# Altium project M_PCT_2.PrjPcb
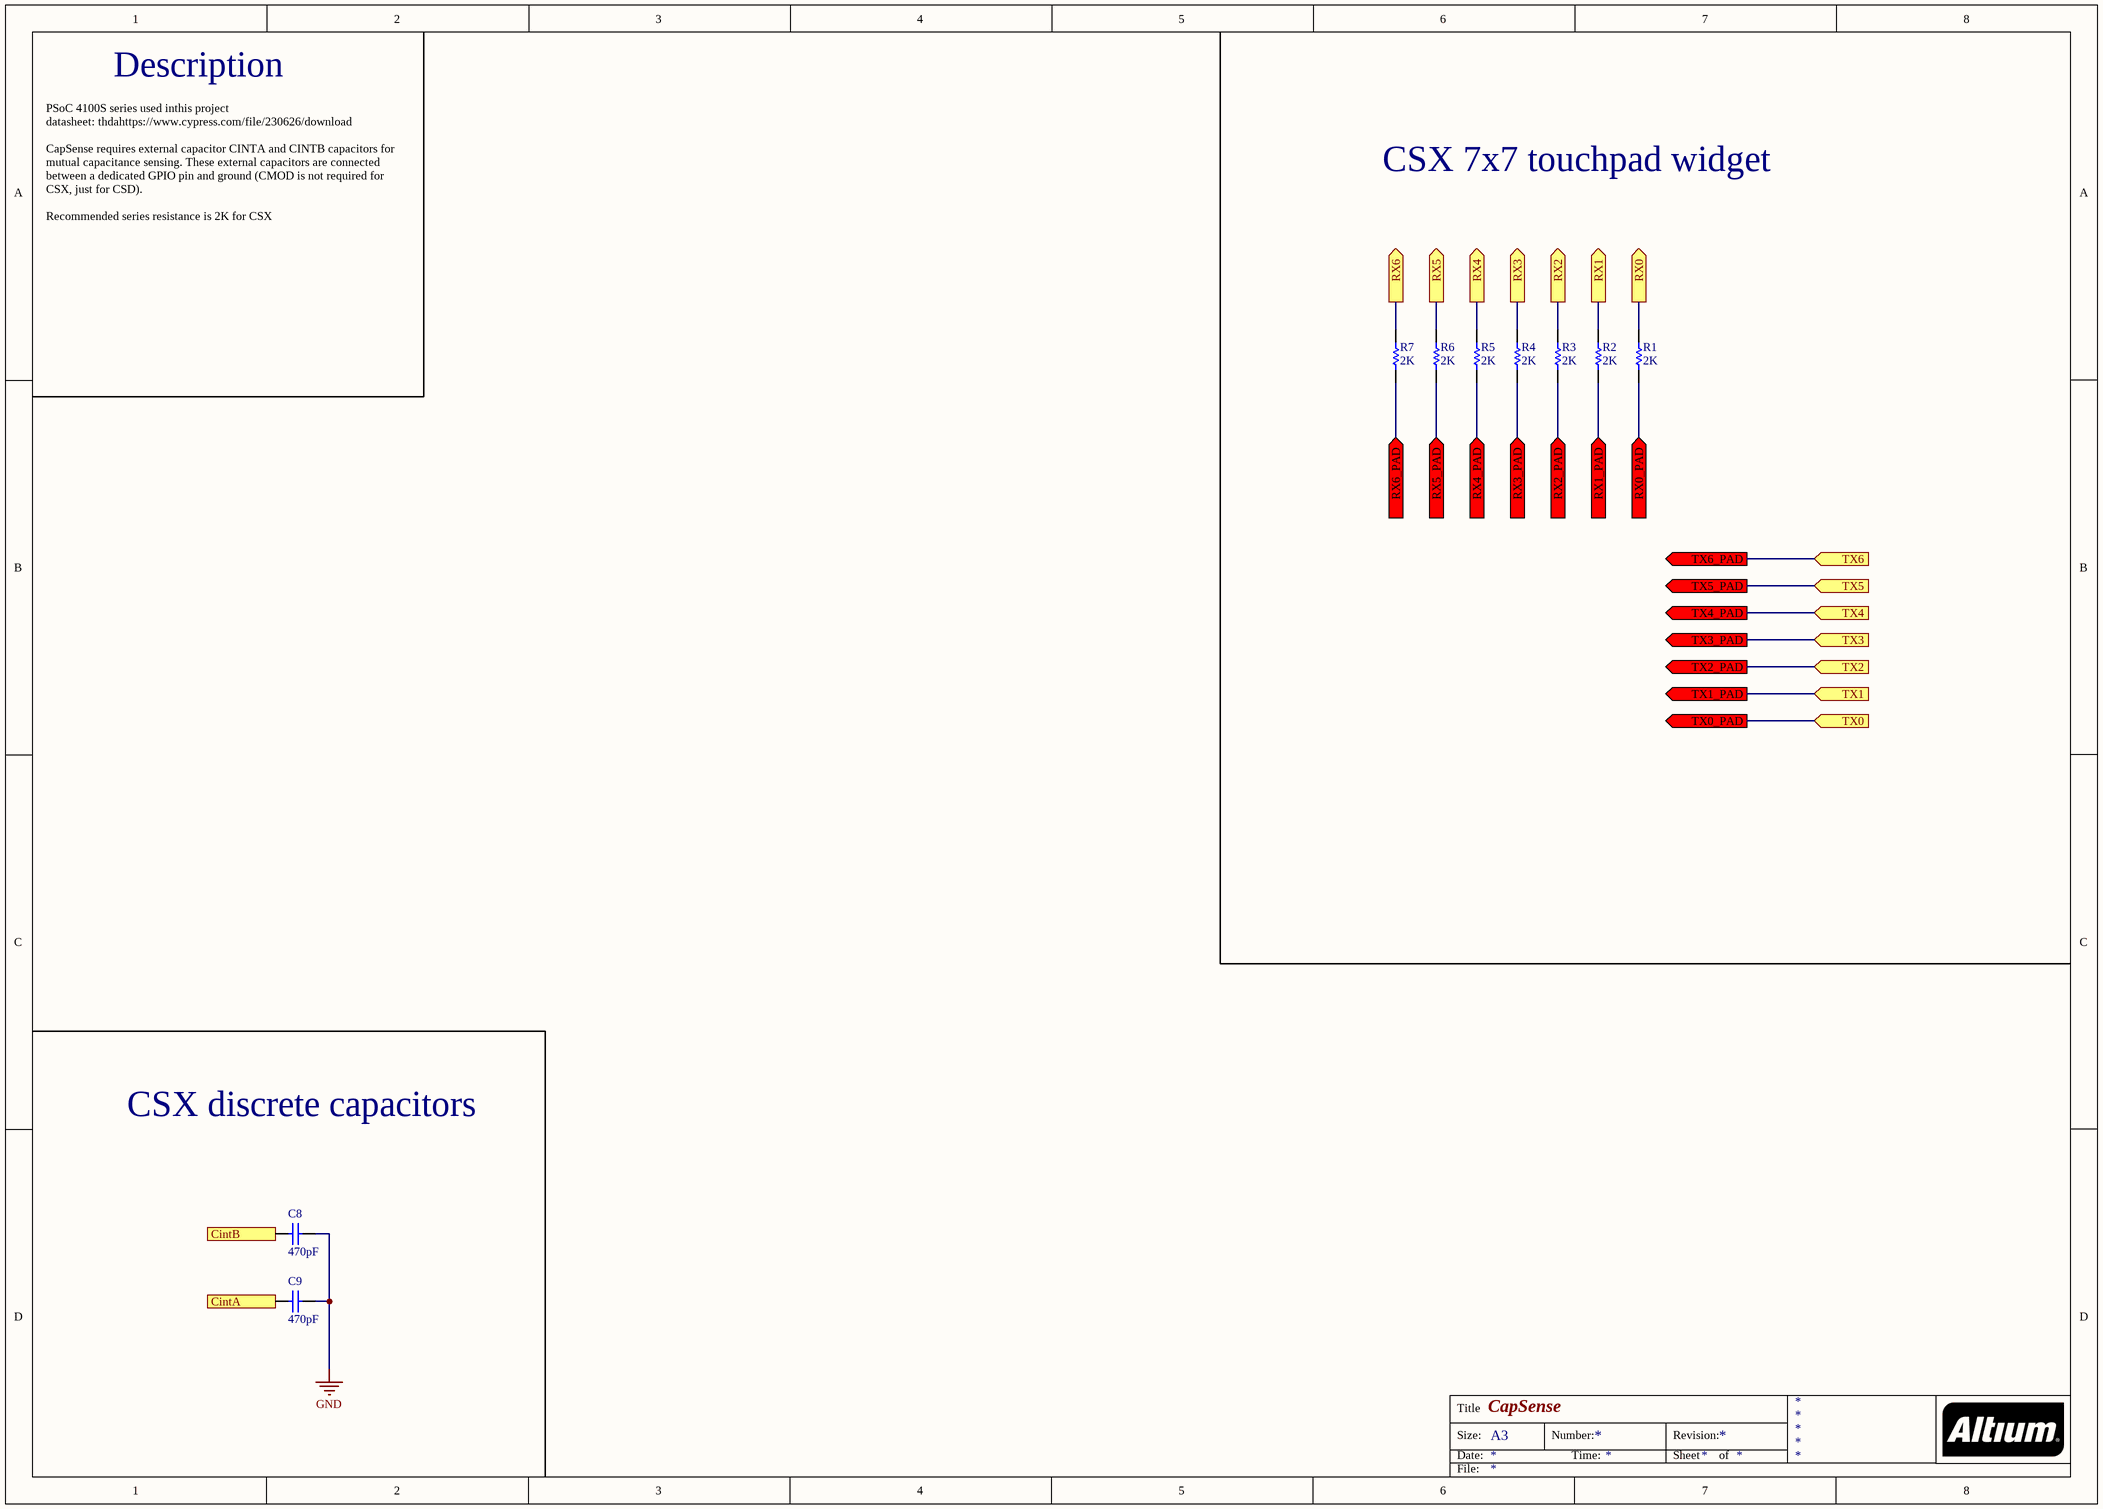
[diagram p0: CapSense.SchDoc]
3 sheets, 32 parts. Net scope: flat (ports and power ports of the same name join across sheets).
Board file: MPCT_v2_Manipora.PcbDoc
Sheets:
  CapSense.SchDoc
  CY8C4125AZI-S433.SchDoc
  Communication.SchDoc

## Sheet CapSense.SchDoc: CapSense
size A3

### Parts
C8  470pF  [CAPC0603(1608)100_N]
C9  470pF  [CAPC0603(1608)100_N]
R1  2K  [RESC0603(1608)_N]
R2  2K  [RESC0603(1608)_N]
R3  2K  [RESC0603(1608)_N]
R4  2K  [RESC0603(1608)_N]
R5  2K  [RESC0603(1608)_N]
R6  2K  [RESC0603(1608)_N]
R7  2K  [RESC0603(1608)_N]

### Ports
CintA, CintB, RX0 (out), RX0_PAD (in), RX1 (out), RX1_PAD (in), RX2 (out), RX2_PAD (in), RX3 (out), RX3_PAD (in), RX4 (out), RX4_PAD (in), RX5 (out), RX5_PAD (in), RX6 (out), RX6_PAD (in), TX0 (in), TX0_PAD (out), TX1 (in), TX1_PAD (out), TX2 (in), TX2_PAD (out), TX3 (in), TX3_PAD (out), TX4 (in), TX4_PAD (out), TX5 (in), TX5_PAD (out), TX6 (in), TX6_PAD (out)

### Nets
GND: C8.2 C9.2
CintA: C9.1 ; port CintA
CintB: C8.1 ; port CintB
RX0: R1.1 ; port RX0
RX0_PAD: R1.2 ; port RX0_PAD
RX1: R2.1 ; port RX1
RX1_PAD: R2.2 ; port RX1_PAD
RX2: R3.1 ; port RX2
RX2_PAD: R3.2 ; port RX2_PAD
RX3: R4.1 ; port RX3
RX3_PAD: R4.2 ; port RX3_PAD
RX4: R5.1 ; port RX4
RX4_PAD: R5.2 ; port RX4_PAD
RX5: R6.1 ; port RX5
RX5_PAD: R6.2 ; port RX5_PAD
RX6: R7.1 ; port RX6
RX6_PAD: R7.2 ; port RX6_PAD
TX0: port TX0, port TX0_PAD
TX1: port TX1, port TX1_PAD
TX2: port TX2, port TX2_PAD
TX3: port TX3, port TX3_PAD
TX4: port TX4, port TX4_PAD
TX5: port TX5, port TX5_PAD
TX6: port TX6, port TX6_PAD

### Notes on the sheet
- Description
- CSX 7x7 touchpad widget
- PSoC 4100S series used inthis project
  datasheet: thdahttps://www.cypress.com/file/230626/download
  CapSense requires external capacitor CINTA and CINTB capacitors for mutual capacitance sensing. These external capacitors are connected between a dedicated GPIO pin and ground (CMOD is not required for CSX, just for CSD).
  Recommended series resistance is 2K for CSX
- CSX discrete capacitors
- Title
- Size:
- Date:
- A3
- Number:
- Time:
- Revision:
- Sheet
- of
- File:

### Library data of the parts
C8 C9 = CMP-1035-01661-1: CAP 470pF 10V ±10% 0603 (1608 Metric) Thickness 1mm SMD; Case-EIA: 0603; Tolerance: Â±10%; Case-Metric: 1608; Max Thickness: 1 mm; Rated Voltage: 10 V; Technology: SMT; Value: 470pF
R1-R7 = CMP-1012-00081-1: 2K 0.1W 5% 0603 (1608 Metric)  SMD; Case-Metric: 1608; Value: 2000.00 Ohm; Case-EIA: 0603; Tolerance: 5 %; Technology: SMT; Power: 0.1 W

## Sheet CY8C4125AZI-S433.SchDoc: CY8C4125AZI-S433
size A3
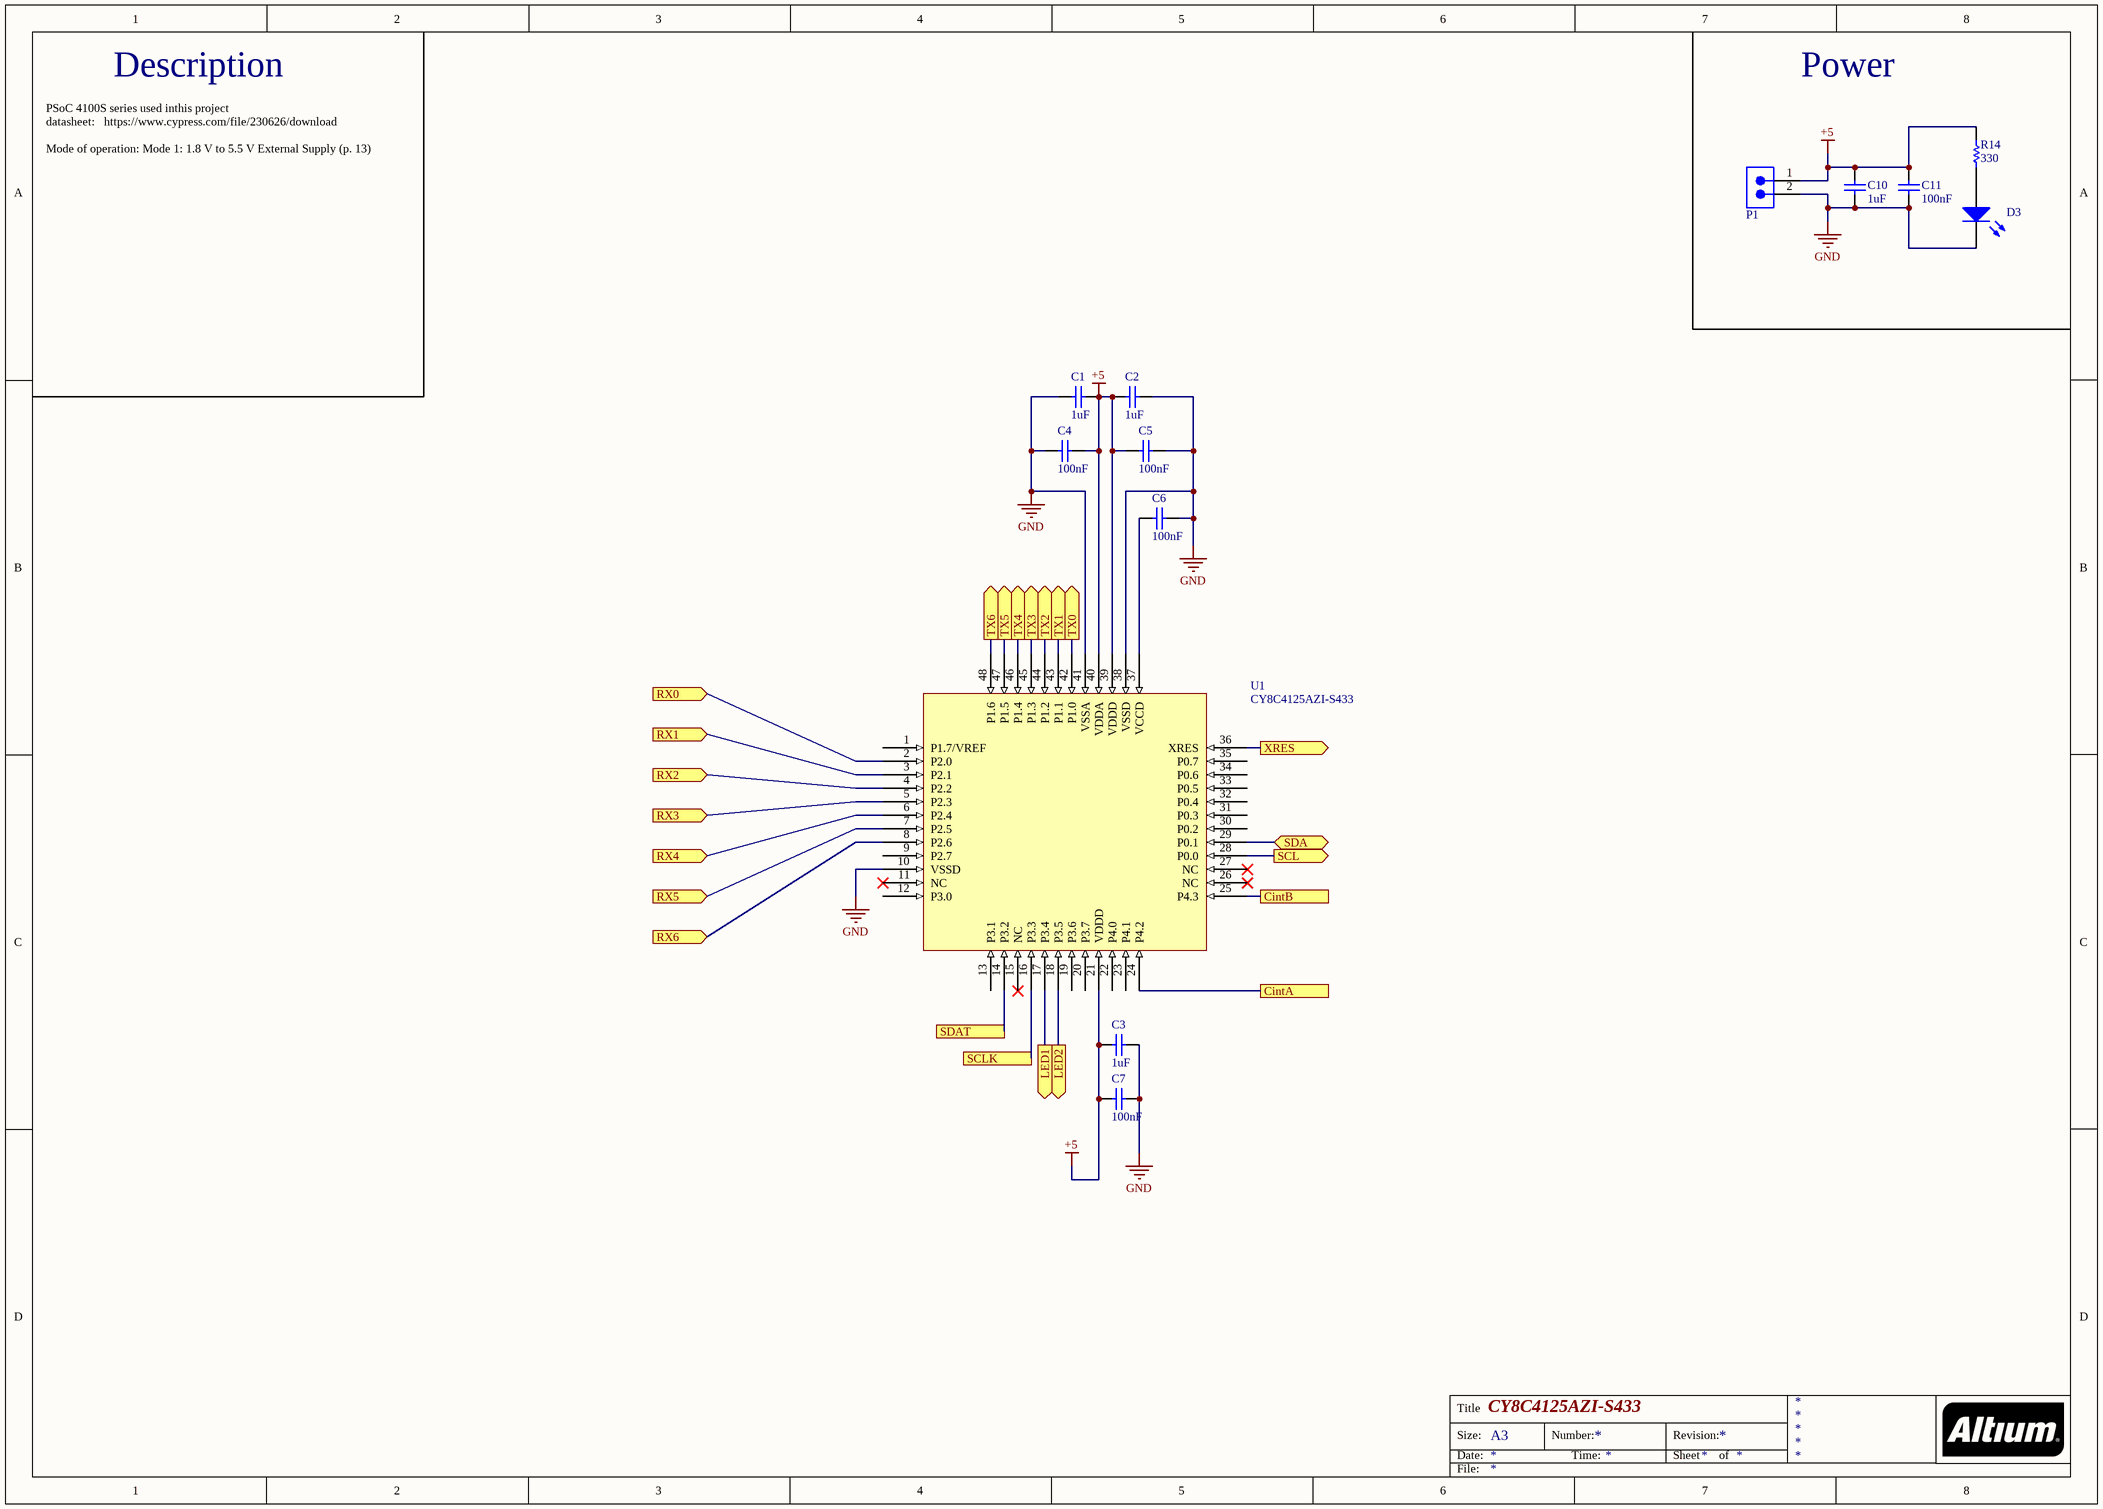
[diagram p1: CY8C4125AZI-S433.SchDoc]

### Parts
C1  1uF  [CAPC0603(1608)100_N]
C2  1uF  [CAPC0603(1608)100_N]
C3  1uF  [CAPC0603(1608)100_N]
C4  100nF  [CAPC1608X90X20LL10]
C5  100nF  [CAPC1608X90X20LL10]
C6  100nF  [CAPC1608X90X20LL10]
C7  100nF  [CAPC1608X90X20LL10]
C10  1uF  [CAPC0603(1608)100_N]
C11  100nF  [CAPC1608X90X20LL10]
D3  150060BS75000  [0603_A]  (value not drawn)
P1  MTLW-102-05-T-S-172  [SMTC-MTLW-102-05-X-S-172]  (value not drawn)
R14  330  [RESC0603(1608)_L]
U1  CY8C4125AZI-S433  [CY8C4125AZI-S433]

### Ports
CintA, CintB, LED1 (out), LED2 (out), RX0 (in), RX1 (in), RX2 (in), RX3 (in), RX4 (in), RX5 (in), RX6 (in), SCL (out), SCLK, SDA (bidir), SDAT, TX0 (out), TX1 (out), TX2 (out), TX3 (out), TX4 (out), TX5 (out), TX6 (out), XRES (out)

### Nets
+5: C1.2 C2.1 C3.1 C4.2 C5.1 C7.1 C10.2 C11.2 P1.1 R14.1 U1.21(VDDD) U1.39(VDDD) U1.40(VDDA)
GND: C1.1 C2.2 C3.2 C4.1 C5.2 C6.2 C7.2 C10.1 C11.1 D3.1(K) P1.2 U1.10(VSSD) U1.38(VSSD) U1.41(VSSA)
CintA: U1.24(P4.2) ; port CintA
CintB: U1.25(P4.3) ; port CintB
LED1: U1.17(P3.4) ; port LED1
LED2: U1.18(P3.5) ; port LED2
RX0: U1.2(P2.0) ; port RX0
RX1: U1.3(P2.1) ; port RX1
RX2: U1.4(P2.2) ; port RX2
RX3: U1.5(P2.3) ; port RX3
RX4: U1.6(P2.4) ; port RX4
RX5: U1.7(P2.5) ; port RX5
RX6: U1.8(P2.6) ; port RX6
SCL: U1.28(P0.0) ; port SCL
SCLK: U1.16(P3.3) ; port SCLK
SDA: U1.29(P0.1) ; port SDA
SDAT: U1.14(P3.2) ; port SDAT
TX0: U1.42(P1.0) ; port TX0
TX1: U1.43(P1.1) ; port TX1
TX2: U1.44(P1.2) ; port TX2
TX3: U1.45(P1.3) ; port TX3
TX4: U1.46(P1.4) ; port TX4
TX5: U1.47(P1.5) ; port TX5
TX6: U1.48(P1.6) ; port TX6
XRES: U1.36(XRES) ; port XRES
NetC6_1: C6.1 U1.37(VCCD)
NetD3_2: D3.2(A) R14.2

Not connected (* = marked no-connect by the designer): U1 1(P1.7/VREF) 9(P2.7) 11(NC)* 12(P3.0) 13(P3.1) 15(NC)* 19(P3.6) 20(P3.7) 22(P4.0) 23(P4.1) 26(NC)* 27(NC)* 30(P0.2) 31(P0.3) 32(P0.4) 33(P0.5) 34(P0.6) 35(P0.7)

### Notes on the sheet
- Description
- Power
- PSoC 4100S series used inthis project
  datasheet:   https://www.cypress.com/file/230626/download
  Mode of operation: Mode 1: 1.8 V to 5.5 V External Supply (p. 13)
- Title
- Size:
- Date:
- A3
- Number:
- Time:
- Revision:
- Sheet
- of
- File:

### Library data of the parts
C1-C3 C10 = CMP-1035-02746-1: CAP 1uF 50V ±20% 0603 (1608 Metric) Thickness 1mm SMD; Tolerance: Â±20%; Case-EIA: 0603; Case-Metric: 1608; Value: 1uF; Technology: SMT; Max Thickness: 1 mm; Rated Voltage: 50 V
C4-C7 C11 = CMP-2000-07546-1: CGA3E2X7R1H104K080AA Chip Capacitor, 0.1 uF, +/- 10%, 50 V, -55 to 125 degC, 0603 (1608 Metric), RoHS, Tape and Reel; Manufacturer: TDK; Voltage: 50V; Dielectric: X7R; Package Reference: 603; Radiation Hardening: No; Composition: Ceramic; Datasheet URL: https://product.tdk.com/info/en/catalog/datasheets/mlcc_automotive_general_en.pdf; Mounting Technology: SurfaceMount; Datasheet Version: 12/2014; Width: 0.8mm; Length: 1.6mm; Capacitance: 100nF; Tolerance: 10%; Case Code (Imperial): 0603; RoHSCompliant: True; Min Operating Temperature: -55degC; Package Description: 2-Pin Surface Mount Device, Body 1.6 x 0.8 mm; Packaging: TapeandReel; Package Quantity: 1; Voltage Rating: 50V; Mount: SurfaceMount; Lead Free: LeadFree; Depth: 0.8mm; Termination: SMD/SMT; Case Code (Metric): 1608; Thickness: 0.035inch; Height: 0.8mm; Weight: 7.1E-05oz; Voltage Rating (DC): 50V; REACH SVHC: NoSVHC; Manufacturer URL: http://www.tdk.com/; Case/Package: 0603; Max Operating Temperature: 125degC
D3 = CMP-1426-00003-1: SMD mono-color Chip LED, WL-SMCW, Blue; Manufacturer: Wuerth Elektronik; Color: Blue; ComponentLink2Description: Datasheet; ComponentLink2URL: http://katalog.we-online.com/led/datasheet/150060BS75000.pdf; ComponentLink1URL: http://www.we-online.com; PackageReference: 0603_A; PartNumber: 150060BS75000; ComponentLink1Description: Manufacturer URL
P1 = CMP-1024-00065-1: Low Profile .025" SQ Post Header, Through-hole, Vertical, -55 to 105 degC, 2.54 mm Pitch, 2-Pin, Male, RoHS; Manufacturer: Samtec; Pitch: 2.54 mm; ComponentLink2URL: http://www.samtec.com/documents/webfiles/pdf/MTLW_TH.PDF; PackageReference: MTLW-102-05-X-S-172; Mounting Technology: Through-hole; DatasheetVersion: F-214; Temperature Range: -55 to 105 degC; ComponentLink2Description: Datasheet; Orientation: Vertical; ComponentLink3Description: Package Specification; RoHS: True; PackageDescription: Low Profile Terminal Assembly; ComponentLink3URL: http://www.samtec.com/documents/webfiles/cpdf/MTLW-1XX-XX-XX-X-XXX-XX-XX-MKT1.pdf; ComponentLink1Description: Manufacturer URL; PartNumber: MTLW-102-05-T-S-172; PackageVersion: T, 6/1991; ComponentLink1URL: http://www.samtec.com
R14 = CMP-1012-00062-1: 330R 0.1W 5% 0603 (1608 Metric)  SMD; Value: 330.00 Ohm; Case-EIA: 0603; Case-Metric: 1608; Tolerance: 5 %; Power: 0.1 W; Technology: SMT

## Sheet Communication.SchDoc: Communication
size A4
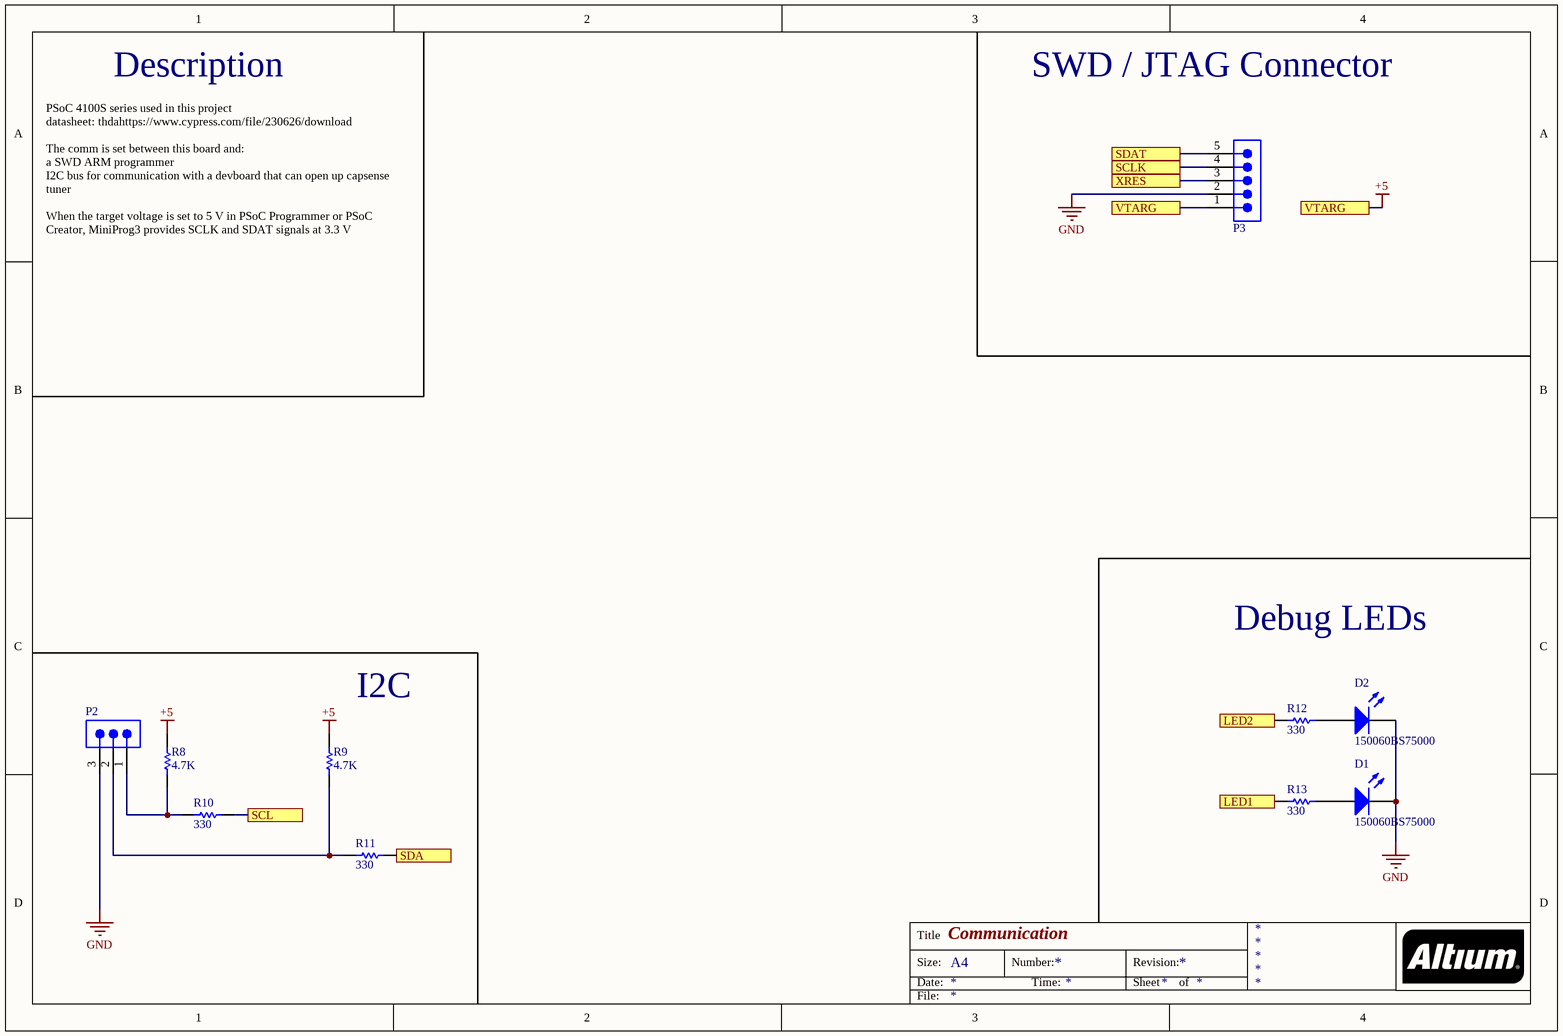
[diagram p2: Communication.SchDoc]

### Parts
D1  150060BS75000  [0603_A]
D2  150060BS75000  [0603_A]
P2  TSW-103-07-F-S  [SMTC-TSW-103-07-X-S]  (value not drawn)
P3  MTLW-105-05-L-S-190  [SMTC-MTLW-105-05-X-S-190]  (value not drawn)
R8  4.7K  [RESC1608X55X25ML10T15]
R9  4.7K  [RESC1608X55X25ML10T15]
R10  330  [RESC0603(1608)_L]
R11  330  [RESC0603(1608)_L]
R12  330  [RESC0603(1608)_L]
R13  330  [RESC0603(1608)_L]

### Ports
LED1 (in), LED2 (in), SCL, SCLK, SDA, SDAT, VTARG, XRES

### Nets
+5: P3.1 R8.2 R9.2 ; port VTARG
GND: D1.1(K) D2.1(K) P2.3 P3.2
LED1: R13.1 ; port LED1
LED2: R12.1 ; port LED2
SCL: R10.2 ; port SCL
SCLK: P3.4 ; port SCLK
SDA: R11.2 ; port SDA
SDAT: P3.5 ; port SDAT
XRES: P3.3 ; port XRES
NetD1_2: D1.2(A) R13.2
NetD2_2: D2.2(A) R12.2
NetP2_1: P2.1 R8.1 R10.1
NetP2_2: P2.2 R9.1 R11.1

### Notes on the sheet
- Description
- SWD / JTAG Connector
- PSoC 4100S series used in this project
  datasheet: thdahttps://www.cypress.com/file/230626/download
  The comm is set between this board and:
  a SWD ARM programmer
  I2C bus for communication with a devboard that can open up capsense tuner
  When the target voltage is set to 5 V in PSoC Programmer or PSoC Creator, MiniProg3 provides SCLK and SDAT signals at 3.3 V
- Debug LEDs
- (near R9) I2C
- Title
- Size:
- Date:
- A4
- Number:
- Time:
- Revision:
- Sheet
- of
- File:

### Library data of the parts
D1 D2 = CMP-1426-00003-1: as D3 on sheet CY8C4125AZI-S433; Color: Blue; ComponentLink2Description: Datasheet; ComponentLink2URL: http://katalog.we-online.com/led/datasheet/150060BS75000.pdf; ComponentLink1URL: http://www.we-online.com; PackageReference: 0603_A; PartNumber: 150060BS75000; ComponentLink1Description: Manufacturer URL
P2 = CMP-1024-00331-1: 0.025" SQ Post Header, Through-hole, Vertical, -55 to 125 degC, 2.54 mm Pitch, 3-Pin, Male, RoHS; Manufacturer: Samtec; Pitch: 2.54 mm; DatasheetVersion: F-214; ComponentLink1Description: Manufacturer URL; ComponentLink3URL: http://www.samtec.com/documents/webfiles/cpdf/TSW-XXX-XX-XXX-X-XX-XXX-MKT.pdf; Mounting Technology: Through-hole; PackageDescription: .025[0.64] SQ. Post Terminal Strip Assembly; Temperature Range: -55 to 125 degC; ComponentLink3Description: Package Specification; Orientation: Vertical; PartNumber: TSW-103-07-F-S; RoHS: True; PackageVersion: DM, 8/1988; ComponentLink2Description: Datasheet; ComponentLink1URL: http://www.samtec.com; ComponentLink2URL: http://www.samtec.com/documents/webfiles/pdf/TSW_TH.PDF; PackageReference: TSW-103-07-X-S
P3 = CMP-1024-00079-1: Low Profile .025" SQ Post Header, Through-hole, Vertical, -55 to 125 degC, 2.54 mm Pitch, 5-Pin, Male, RoHS; Manufacturer: Samtec; Pitch: 2.54 mm; Mounting Technology: Through-hole; ComponentLink2Description: Datasheet; DatasheetVersion: F-214; Temperature Range: -55 to 125 degC; ComponentLink1Description: Manufacturer URL; Orientation: Vertical; ComponentLink2URL: http://www.samtec.com/documents/webfiles/pdf/MTLW_TH.PDF; PackageDescription: Low Profile Terminal Assembly; PackageVersion: T, 6/1991; RoHS: True; ComponentLink3Description: Package Specification; ComponentLink1URL: http://www.samtec.com; PackageReference: MTLW-105-05-X-S-190; ComponentLink3URL: http://www.samtec.com/documents/webfiles/cpdf/MTLW-1XX-XX-XX-X-XXX-XX-XX-MKT1.pdf; PartNumber: MTLW-105-05-L-S-190
R8 R9 = CMP-2000-05024-1: RC0603JR-074K7L Chip Resistor, 4.7 KOhm, +/- 5%, 100 mW, -55 to 155 degC, 0603 (1608 Metric), RoHS, Tape and Reel; Manufacturer: Yageo; Resistance: 4.7kOhms; Temperature Coefficient: 100PPM/C; Power Rating: 100mW; Voltage Rating: 50V; Operating Temperature Range: -55Cto+155C; Case Code - mm: 1608; Tolerance: 5%; Product: ThickFilmResistorsGeneralPurpose; Case Code - in: 0603; Datasheet URL: http://www.yageo.com/documents/recent/PYu-RC_Group_51_RoHS_L_04.pdf; Package Reference: 603; Datasheet Version: Rev. 4, 02/2016; Package Description: 2-Pin Surface Mount Device, Body 1.6 x 0.8 mm; Manufacturer URL: http://www.yageo.com/; Series: RC; Packaging: Reel; Termination Style: SMD/SMT
R10-R13 = CMP-1012-00062-1: as R14 on sheet CY8C4125AZI-S433; Tolerance: 5 %; Power: 0.1 W; Technology: SMT

## Nets that join several sheets
+5: CY8C4125AZI-S433 (13 pins), Communication (P3.1 R8.2 R9.2)
GND: CapSense (C8.2 C9.2), CY8C4125AZI-S433 (14 pins), Communication (D1.1 D2.1 P2.3 P3.2)
CintA: CapSense (C9.1), CY8C4125AZI-S433 (U1.24)
CintB: CapSense (C8.1), CY8C4125AZI-S433 (U1.25)
LED1: CY8C4125AZI-S433 (U1.17), Communication (R13.1)
LED2: CY8C4125AZI-S433 (U1.18), Communication (R12.1)
RX0: CapSense (R1.1), CY8C4125AZI-S433 (U1.2)
RX1: CapSense (R2.1), CY8C4125AZI-S433 (U1.3)
RX2: CapSense (R3.1), CY8C4125AZI-S433 (U1.4)
RX3: CapSense (R4.1), CY8C4125AZI-S433 (U1.5)
RX4: CapSense (R5.1), CY8C4125AZI-S433 (U1.6)
RX5: CapSense (R6.1), CY8C4125AZI-S433 (U1.7)
RX6: CapSense (R7.1), CY8C4125AZI-S433 (U1.8)
SCL: CY8C4125AZI-S433 (U1.28), Communication (R10.2)
SCLK: CY8C4125AZI-S433 (U1.16), Communication (P3.4)
SDA: CY8C4125AZI-S433 (U1.29), Communication (R11.2)
SDAT: CY8C4125AZI-S433 (U1.14), Communication (P3.5)
XRES: CY8C4125AZI-S433 (U1.36), Communication (P3.3)